# EAGLE design LiFePO4_Charger_V2 (EAGLE 9.6.2)
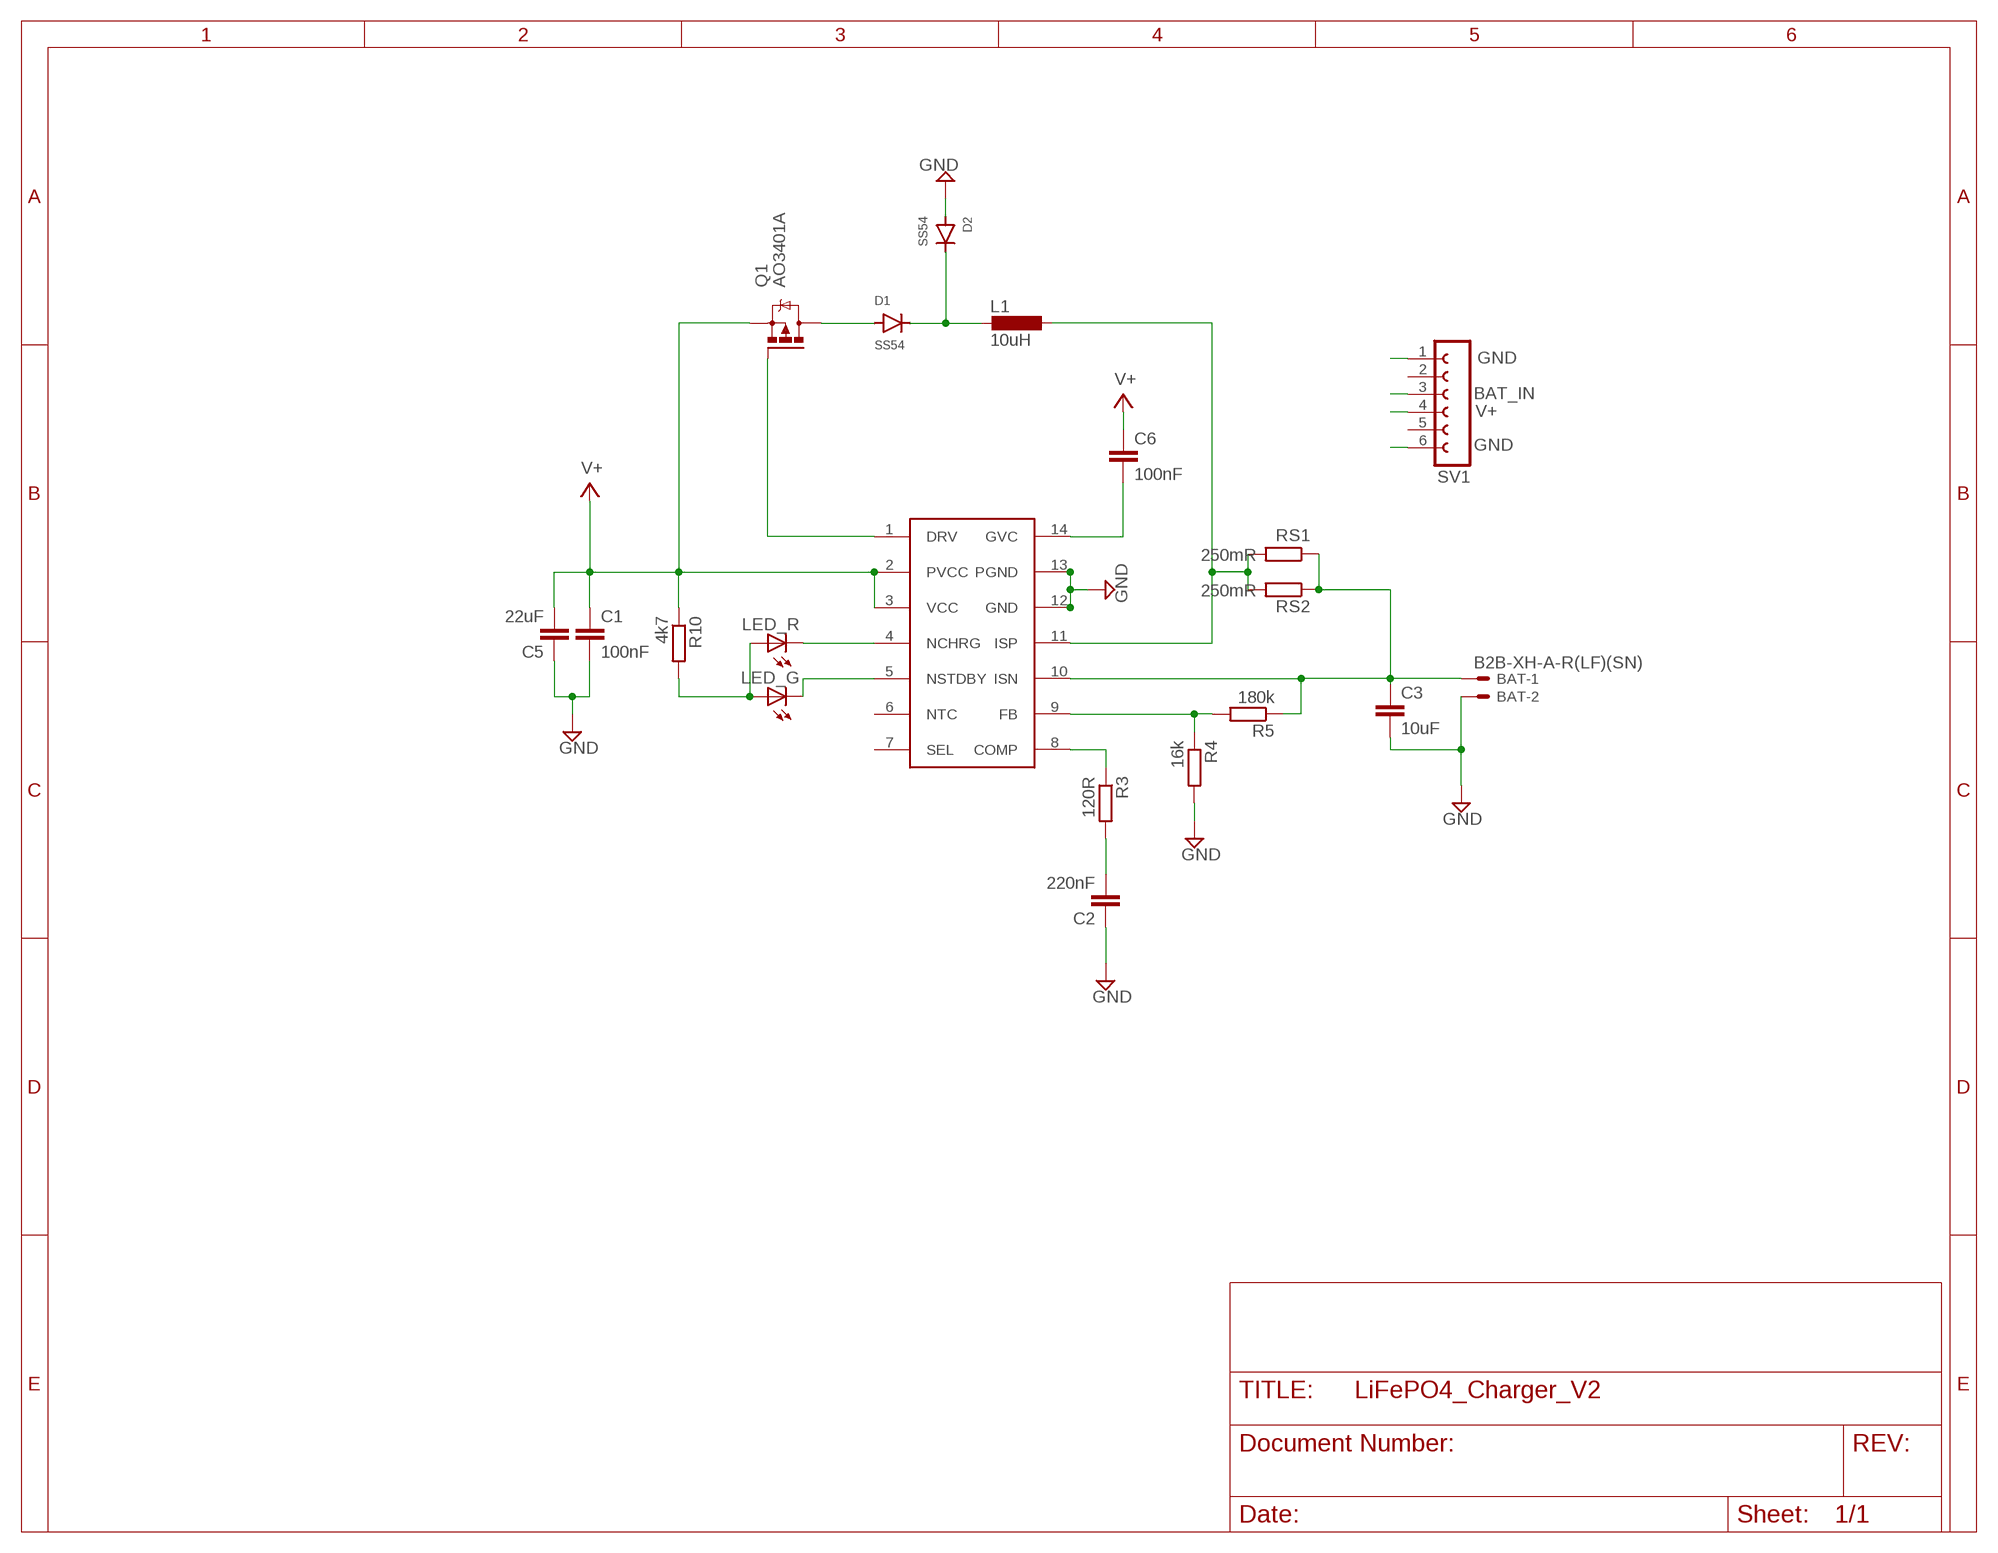
[diagram p0: schematic, sheet 1]

## Parts
BAT  B2B-XH-A-R(LF)(SN)  JST-XH-02-PIN-LONG-PAD  [JST-XH-02-PACKAGE-LONG-PAD]
C1  100nF  C-EUC0805  [C0805]
C2  220nF  C-EUC0805  [C0805]
C3  10uF  C-EUC0805  [C0805]
C5  22uF  C-EUC0805  [C0805]
C6  100nF  C-EUC0805  [C0805]
D1  SS54  S1M  [SMA]
D2  SS54  S1M  [SMA]
IC1  SLM6900  SLM9000TSSOP14L  [TSSOP14]
L1  10uH  FXL0630-100-M  [FXL0630-100-M]
LED_G  LEDCHIPLED_0805  [CHIPLED_0805]
LED_R  LEDCHIPLED_0805  [CHIPLED_0805]
Q1  AO3401A  IRLML5203  [MICRO3]
R3  120R  R-EU_R0603  [R0603]
R4  16k  R-EU_R0805  [R0805]
R5  180k  R-EU_R0603  [R0603]
R10  4k7  R-EU_R0603  [R0603]
RS1  250mR  R-EU_R1206  [R1206]
RS2  250mR  R-EU_R1206  [R1206]
SV1  FE06W  [FE06W]

## Nets
BAT_IN [pwr]: BAT.1 C3.1 IC1.10(ISN) R5.1 RS1.1 RS2.1 SV1.3
GND [pwr]: BAT.2 C1.2 C2.1 C3.2 C5.1 D2.A IC1.12(GND) IC1.13(PGND) R4.2 SV1.1 SV1.6
N$1: IC1.4(NCHRG) LED_R.C
N$2: IC1.5(NSTDBY) LED_G.C
N$3: LED_G.A LED_R.A R10.2
N$4: C6.2 IC1.14(GVC)
N$5: IC1.8(COMP) R3.1
N$6: C2.2 R3.2
N$7: D1.C D2.C L1.P$1
N$9: IC1.9(FB) R4.1 R5.2
N$12: D1.A Q1.3(D)
N$13: IC1.1(DRV) Q1.1(G)
N$14: IC1.11(ISP) L1.P$2 RS1.2 RS2.2
V+ [pwr]: C1.1 C5.2 C6.1 IC1.2(PVCC) IC1.3(VCC) Q1.2(S) R10.1 SV1.4
Unconnected: IC1.6(NTC) IC1.7(SEL) SV1.2 SV1.5

## Library data of the parts
BAT = Rembrandt Electronics - JST XH Connectors v1-0:JST-XH-02-PIN: JST XH Connector 2 Pin Wire to board connector. Pitch: 2,54 mm, (0.100") Number of pins: 2 Created by Rembrandt Electronics www.rembrandtelectronics.com
C1-C3 C5 C6 = rcl:C-EU: CAPACITOR, European symbol; SPICEPREFIX: C
D1 D2 = diode:S1M
IC1 = MK312parts:SLM9000
L1 = MK312parts:FXL0630-100-M
LED_G LED_R = adafruit:LED: LED OSRAM: - CHIPLED LG R971, LG N971, LY N971, LG Q971, LY Q971, LO R971, LY R971 LH N974, LH R974 LS Q976, LO Q976, LY Q976 LO Q996 - Hyper CHIPLED LW Q18S LB Q993, LB Q99A, LB R99A - SideLED LS A670, LO A670, LY A670, LG A670, LP A670 LB A673, LV A673, LT A673, LW A673 LH A674 LY A675 LS A676, LA A676, LO A676, LY A676, LW A676 LS A679, LY A679, LG A679 - Hyper Micro SIDELED® LS Y876, LA Y876, LO Y876, LY Y876 LT Y87S - SmartLED LW L88C, LW L88S LB L89C, LB L89S, LG L890 LS L89K, LO L89K, LY L89K LS L896, LA L896, LO L896, LY L896 - TOPLED LS T670, LO T670, LY T670, LG T670, LP T670 LSG T670, LSP T670, LSY T670, LOP T670, LYG T670 LG T671, LOG T671, LSG T671 LB T673, LV T673, LT T673, LW T673 LH T674 LS T676, LA T676, LO T676, LY T676, LB T676, LH T676, LSB T676, LW T676 LB T67C, LV T67C, LT T67C, LS T67K, LO T67K, LY T67K, LW E67C LS E67B, LA E67B, LO E67B, LY E67B, LB E67C, LV E67C, LT E67C LW T67C LS T679, LY T679, LG T679 LS T770, LO T770, LY T770, LG T770, LP T770 LB T773, LV T773, LT T773, LW T773 LH T774 LS E675, LA E675, LY E675, LS T675 LS T776, LA T776, LO T776, LY T776, LB T776 LHGB T686 LT T68C, LB T68C - Hyper Mini TOPLED® LB M676 - Mini TOPLED Santana® LG M470 LS M47K, LO M47K, LY M47K Source: http://www.osram.convergy.de/
Q1 = transistor-power:IRLML5203: HEXFET P-Channel Power MOSFET
R3-R5 R10 RS1 RS2 = rcl:R-EU_: RESISTOR, European symbol; SPICEPREFIX: R
SV1 = con-lsta:FE06W: FEMALE HEADER; OC_FARNELL: unknown; OC_NEWARK: unknown

## Net classes
0 default: width 0.15 mm, drill 0.35 mm, clearance 0.15 mm
2 pwr: width 0.15 mm, drill 0.35 mm, clearance 0.15 mm

## Board
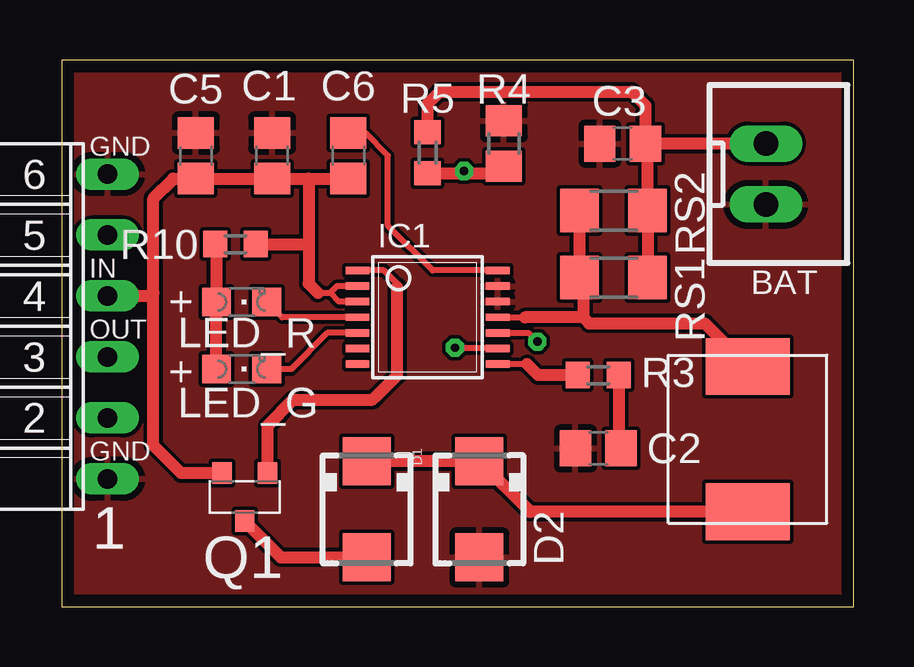
[diagram p1: board, top side]
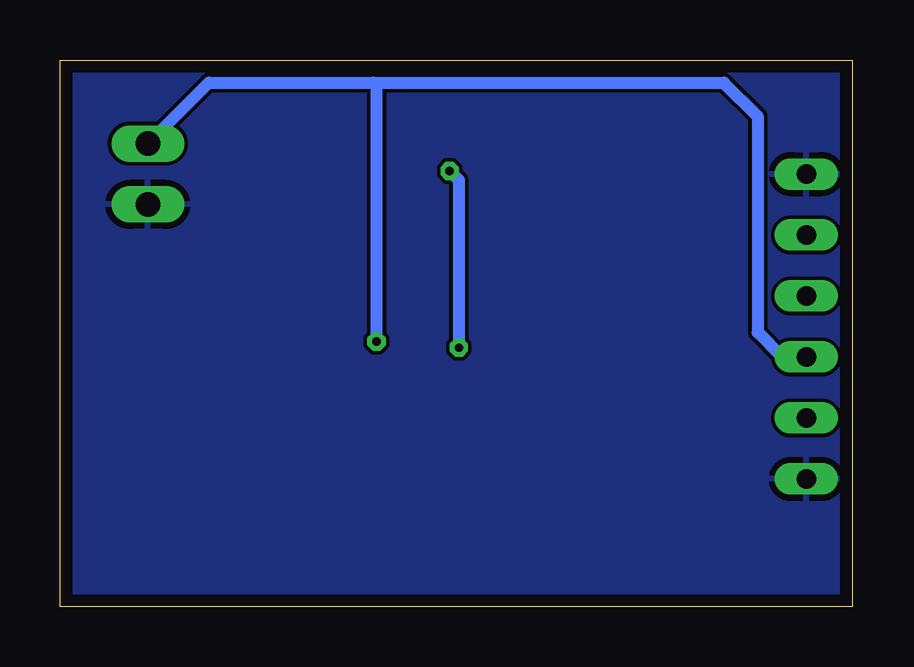
[diagram p2: board, bottom side, seen from below]

Size 33 x 22.78 mm. Coordinates in mm from the lower left corner, seen from the top.
Outline: 0,0 33,0 33,22.78 0,22.78 0,0
Copper layers (1*16): Top 0.035mm / dielectric 1.5mm / Bottom 0.035mm
Design rules "default *": minimum track width 6mil, minimum drill 0.35mm, track to track 6mil, track to pad 6mil, pad to pad 6mil, via to via 6mil, smd to smd 6mil, copper to edge 20mil, drill to drill 6mil, minimum pad ring 10mil, minimum via ring 8mil, stop-mask expansion 4mil, vias tented up to drill 0mil, thermal gap 10mil

### Footprints (pad centres in the part's own frame; a part is rotated, then mirrored left to right if it is on the bottom)
JST-XH-02-PACKAGE-LONG-PAD = drill 1.016 long: 1 -1.27,0; 2 1.27,0
C0805 = smd 1.3 x 1.5: 1 -0.95,0; 2 0.95,0
SMA = smd 2 x 2: A 2,0; C -2,0
TSSOP14 = smd 0.305 x 0.991: 1 -1.95,-2.918; 2 -1.3,-2.918; 3 -0.65,-2.918; 4 0,-2.918; 5 0.65,-2.918; 6 1.3,-2.918; 7 1.95,-2.918; 8 1.95,2.918; 9 1.3,2.918; 10 0.65,2.918; 11 0,2.918; 12 -0.65,2.918; 13 -1.3,2.918; 14 -1.95,2.918
FXL0630-100-M = smd 2.37 x 3.5: P$1 -3.03,0; P$2 3.03,0
CHIPLED_0805 = smd 1.2 x 1.2: A 0,-1.05; C 0,1.05
MICRO3 = smd 0.8 x 0.9: 1 -0.95,-1; 2 0.95,-1; 3 0,1
R0603 = smd 1 x 1.1: 1 -0.85,0; 2 0.85,0
R0805 = smd 1.3 x 1.5: 1 -0.95,0; 2 0.95,0
R1206 = smd 1.6 x 1.803: 1 -1.422,0; 2 1.422,0
FE06W = drill 0.813 long: 1 -6.35,0; 2 -3.81,0; 3 -1.27,0; 4 1.27,0; 5 3.81,0; 6 6.35,0

### Placement (x,y rotation side)
BAT  29.34,18.03 270 top
C1  8.76,18.8 90 top
C2  22.35,6.6 0 top
C3  23.37,19.3 180 top
C5  5.59,18.8 270 top
C6  11.94,18.8 90 top
D1  12.7,4.06 270 top
D2  17.4,4.06 270 top
IC1  15.24,12.06 270 top
L1  28.57,6.99 90 top
LED_G  7.49,9.91 270 top
LED_R  7.49,12.7 270 top
Q1  7.62,4.57 180 top
R3  22.35,9.65 0 top
R4  18.41,19.3 90 top
R5  15.24,18.92 270 top
R10  7.24,15.11 180 top
RS1  22.99,13.72 180 top
RS2  22.99,16.51 180 top
SV1  1.91,11.68 90 top

### Tracks (layer width: path | path; a pad name or v marks a point on that pad's centre or on a via)
BAT_IN  (via drill 0.35)
  Top 0.254: v19.81,11.05 19.45,11.41 IC1.10
  Top 0.508: RS1.1 RS2.1 24.41,19.21 C3.1 | C3.1 24.32,20.89 23.75,21.46 15.75,21.46 15.24,20.95 R5.1 | BAT.1 C3.1
  Bottom 0.254: 19.81,21.72 19.94,21.84
  Bottom 0.508: SV1.3 2.92,10.41 3.94,11.43 3.94,20.45 5.33,21.84 19.94,21.84 26.8,21.84 BAT.1 | v19.81,11.05 19.81,21.72
GND
  pour Top: 32.51,22.61 32.77,22.35 32.77,0.38 32.51,0.13 0.51,0.13 0.25,0.38 0.25,22.35 0.51,22.61
  pour Bottom: 0.51,22.61 32.51,22.61 32.77,22.35 32.77,0.38 32.51,0.13 0.51,0.13 0.25,0.38 0.25,22.35
N$1
  Top 0.254: IC1.4 9.18,12.06 LED_R.C
N$2
  Top 0.254: IC1.5 11.07,11.41 9.56,9.91 LED_G.C
N$3
  Top 0.254: R10.2 6.44,15.06
  Top 0.508: LED_G.A LED_R.A 6.44,15.06
N$4
  Top 0.254: IC1.14 15.45,14.02 13.59,15.88 13.59,18.8 12.64,19.75 C6.2
N$5
  Top 0.254: 19.39,10.12 IC1.8
  Top 0.508: R3.1 19.85,9.65 19.39,10.12
N$6
  Top 0.254: 23.2,6.7 C2.2
  Top 0.508: R3.2 23.2,6.7
N$7
  Top 0.508: D1.C D2.C 19.51,3.96 L1.P$1
N$9  (via drill 0.35)
  Top 0.254: IC1.9 16.41,10.77 v16.38,10.79
  Top 0.508: R5.2 16.76,18.07 | 16.76,18.07 18.29,18.07 18.29,18.23 R4.1 | v16.76,18.16 16.76,18.07
  Bottom 0.508: v16.76,18.16 16.38,17.78 v16.38,10.79
N$12
  Top 0.508: Q1.3 9.13,2.06 D1.A
N$13
  Top 0.254: 12.95,8.64 13.08,8.76 | 13.97,9.65 13.97,9.78 | 13.97,13.34 13.97,13.46 13.42,14.02 IC1.1
  Top 0.508: Q1.1 8.57,7.55 9.65,8.64 12.95,8.64 | 13.08,8.76 13.97,9.65 | 13.97,9.78 13.97,13.34
N$14
  Top 0.254: IC1.11 19.3,12.06 19.43,12.06 21.72,12.06
  Top 0.508: RS2.2 RS1.2 21.72,13.56 21.72,12.06 | 21.72,12.06 21.97,11.81 26.78,11.81 L1.P$2 | 21.72,12.06 19.3,12.06
V+
  Top 0.254: 10.67,13.08 11.18,13.08 | IC1.2 11.46,13.37 11.18,13.08 | IC1.3 11.54,12.71 11.18,13.08
  Top 0.508: 10.29,17.85 C1.1 C5.2 4.64,17.85 3.81,17.02 3.81,13.08 | 10.29,17.85 C6.1 | SV1.4 3.68,12.95 3.81,13.08 | Q1.2 4.97,5.57 3.81,6.73 3.81,13.08 | 10.29,17.85 10.29,15.11 | 10.29,15.11 10.29,13.46 10.67,13.08 | R10.1 10.29,15.11

### Text on the board
tNames: GND | IN | + | OUT | + | GND | 1